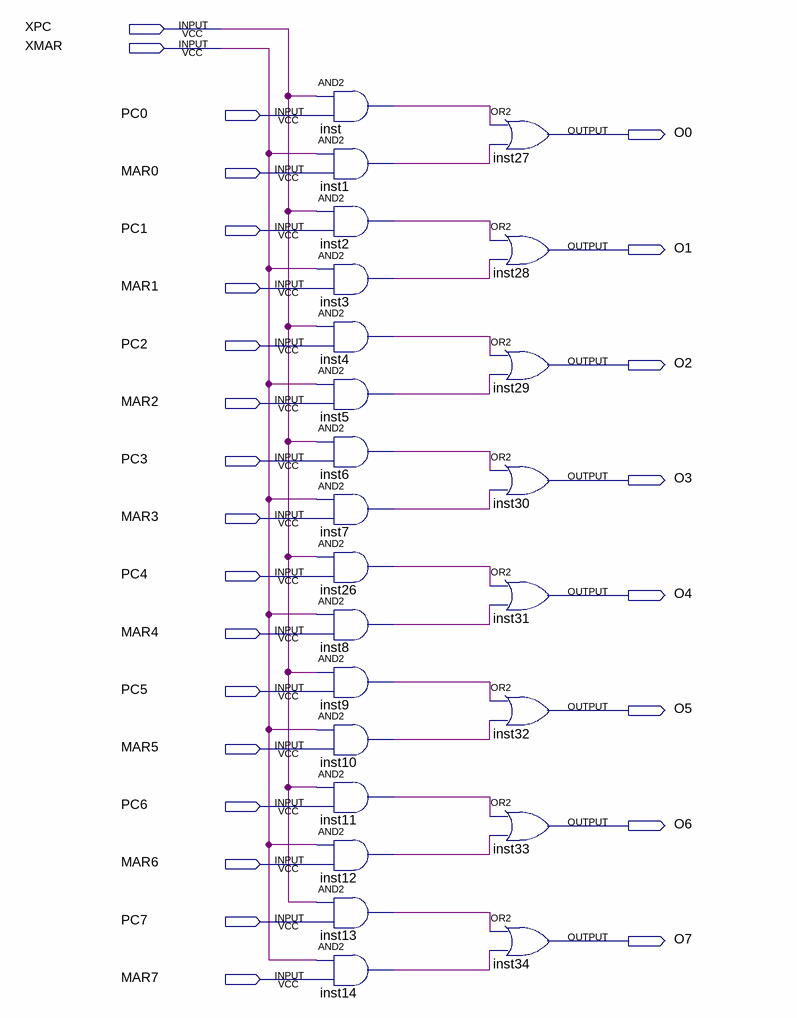
[diagram p0: schematic sheet]
// Quartus schematic selector.bdf as structural Verilog: 24 symbols, 26 pins
module selector (
  input  XPC,
  input  XMAR,
  input  PC0,
  input  MAR0,
  input  PC1,
  input  MAR1,
  input  PC2,
  input  MAR2,
  input  PC3,
  input  MAR3,
  input  PC4,
  input  MAR4,
  input  PC5,
  input  MAR5,
  input  PC6,
  input  MAR6,
  input  PC7,
  input  MAR7,
  output O0,
  output O1,
  output O2,
  output O3,
  output O4,
  output O5,
  output O6,
  output O7
);

  wire inst1_out, inst2_out, inst3_out, inst4_out, inst5_out, inst6_out, inst7_out, inst8_out, inst9_out,
       inst10_out, inst11_out, inst12_out, inst13_out, inst14_out, inst26_out, inst_out;

  and inst (inst_out, XPC, PC0);
  and inst1 (inst1_out, XMAR, MAR0);
  and inst2 (inst2_out, XPC, PC1);
  and inst3 (inst3_out, XMAR, MAR1);
  and inst4 (inst4_out, XPC, PC2);
  and inst5 (inst5_out, XMAR, MAR2);
  and inst6 (inst6_out, XPC, PC3);
  and inst7 (inst7_out, XMAR, MAR3);
  and inst26 (inst26_out, XPC, PC4);
  and inst8 (inst8_out, XMAR, MAR4);
  and inst9 (inst9_out, XPC, PC5);
  and inst10 (inst10_out, XMAR, MAR5);
  and inst11 (inst11_out, XPC, PC6);
  and inst12 (inst12_out, XMAR, MAR6);
  and inst13 (inst13_out, XPC, PC7);
  and inst14 (inst14_out, XMAR, MAR7);
  or inst27 (O0, inst_out, inst1_out);
  or inst28 (O1, inst2_out, inst3_out);
  or inst29 (O2, inst4_out, inst5_out);
  or inst30 (O3, inst6_out, inst7_out);
  or inst31 (O4, inst26_out, inst8_out);
  or inst32 (O5, inst9_out, inst10_out);
  or inst33 (O6, inst11_out, inst12_out);
  or inst34 (O7, inst13_out, inst14_out);
endmodule
